# Altium schematic sheet Sheet1.SchDoc
size A
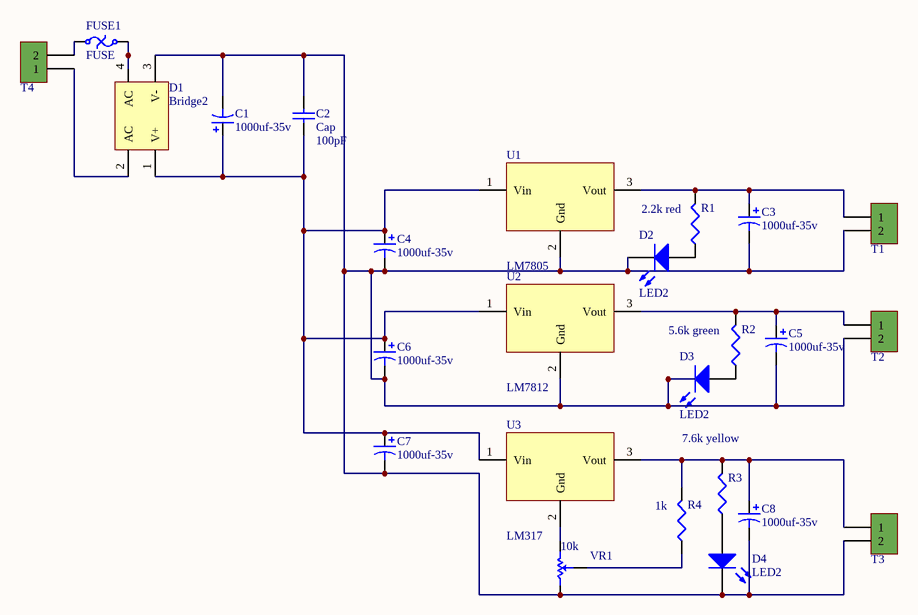
[diagram p0: Sheet1.SchDoc]

## Parts
C1  1000uf-35v  [RB7.6-15]
C2  Cap  value 100pF  [RAD-0.3]
C3  1000uf-35v  [RB7.6-15]
C4  1000uf-35v  [RB7.6-15]
C5  1000uf-35v  [RB7.6-15]
C6  1000uf-35v  [RB7.6-15]
C7  1000uf-35v  [RB7.6-15]
C8  1000uf-35v  [RB7.6-15]
D1  Bridge2  [D-46_6A]
D2  LED2  [3.2X1.6X1.1]
D3  LED2  [3.2X1.6X1.1]
D4  LED2  [3.2X1.6X1.1]
FUSE1  FUSE  [1206_F]
R1  2.2k red  [1206_R]
R2  5.6k green  [1206_R]
R3  7.6k yellow  [1206_R]
R4  1k  [1206_R]
T1  Phoenix 2 Pin  [Phoenix_2PIN_RA_P7.62mm]  (value not drawn)
T2  Phoenix 2 Pin  [Phoenix_2PIN_RA_P7.62mm]  (value not drawn)
T3  Phoenix 2 Pin  [Phoenix_2PIN_RA_P7.62mm]  (value not drawn)
T4  Phoenix 2 Pin  [Phoenix_2PIN_RA_P7.62mm]  (value not drawn)
U1  LM7805  [LM78XXCT_HEATSINK]
U2  LM7812  [LM78XXCT_HEATSINK]
U3  LM317  [LM78XXCT_HEATSINK]
VR1  10k  [POT_WH148]

## Nets
NetC1_1: C1.1 C2.1 C4.1 C6.1 C7.1 D1.1(V+) U1.1(Vin) U2.1(Vin) U3.1(Vin)
NetC1_2: C1.2 C2.2 C3.2 C4.2 C5.2 C6.2 C7.2 C8.2 D1.3(V-) D2.2(K) D3.2(K) D4.2(K) T1.2 T2.2 T3.2 U1.2(Gnd) U2.2(Gnd) VR1.1(CCW)
NetC3_1: C3.1 R1.2(R2) T1.1 U1.3(Vout)
NetC5_1: C5.1 R2.2(R2) T2.1 U2.3(Vout)
NetC8_1: C8.1 R3.2(R2) R4.2(R2) T3.1 U3.3(Vout)
NetD1_2: D1.2(AC) T4.1
NetD1_4: D1.4(AC) FUSE1.2
NetD2_1: D2.1(A) R1.1(R1)
NetD3_1: D3.1(A) R2.1(R1)
NetD4_1: D4.1(A) R3.1(R1)
NetFUSE1_1: FUSE1.1 T4.2
NetR4_1: R4.1(R1) VR1.3(Setpoint)
NetU3_2: U3.2(Gnd) VR1.2(CW)

## Library data of the parts
C1 C3-C8 = Cap Pol1: Polarized Capacitor (Radial); Value: 100pF; Published: 8-Jun-2000; LatestRevisionDate: 17-Jul-2002; LatestRevisionNote: Re-released for DXP Platform.; PackageReference: RB7.6-15; Publisher: Altium Limited; PackageDescription: Polarized Capacitor (Radial); 2 Leads
C2 = Cap: Capacitor; Published: 8-Jun-2000; LatestRevisionDate: 17-Jul-2002; LatestRevisionNote: Re-released for DXP Platform.; PackageReference: RAD-0.3; Publisher: Altium Limited; PackageDescription: Radial Cap, Thru-Hole; 2 Leads; 0.3 in Pin Spacing
D1 = Bridge2: Diode Bridge; Published: 24-Mar-1999; LatestRevisionDate: 17-Jul-2002; LatestRevisionNote: Re-released for DXP Platform.; PackageReference: D-46_6A; Publisher: Altium Limited; PackageDescription: Bridge Rectifier; 4 Terminals; Body 16.8 x 16.8 mm (typ); Pitch 10.67 mm
D2-D4 = LED2: Typical RED, GREEN, YELLOW, AMBER GaAs LED; Published: 8-Jun-2000; LatestRevisionDate: 17-Jul-2002; LatestRevisionNote: Re-released for DXP Platform.; PackageVersion: Feb-2002; PackageReference: 3.2X1.6X1.1; Publisher: Altium Limited; PackageDescription: SM LED; 2 Flat Leads
FUSE1 = FUSE SMD
R1-R3 = Resistor SMD: SMD Resistor; Voltage Rating: [1KV]; Rating: 0.1 W; Value: 1K; Tolerance: [1%]; Operating Temp: -55 to 155 °C; Storage Temp: -55 to 155 °C; ComponentLink1Description: *; ComponentLink1URL: *
R4 = Resistor SMD: SMD Resistor; Voltage Rating: [1KV]; Rating: 0.1 W; Tolerance: [1%]; Operating Temp: -55 to 155 °C; Storage Temp: -55 to 155 °C; ComponentLink1Description: *; ComponentLink1URL: *; Value: 1K
U1-U3 = LM78XX
VR1 = Pot Res Var: Variable Resistor